# Altium project Sequential_Logic_Latch_FF.PrjPcb
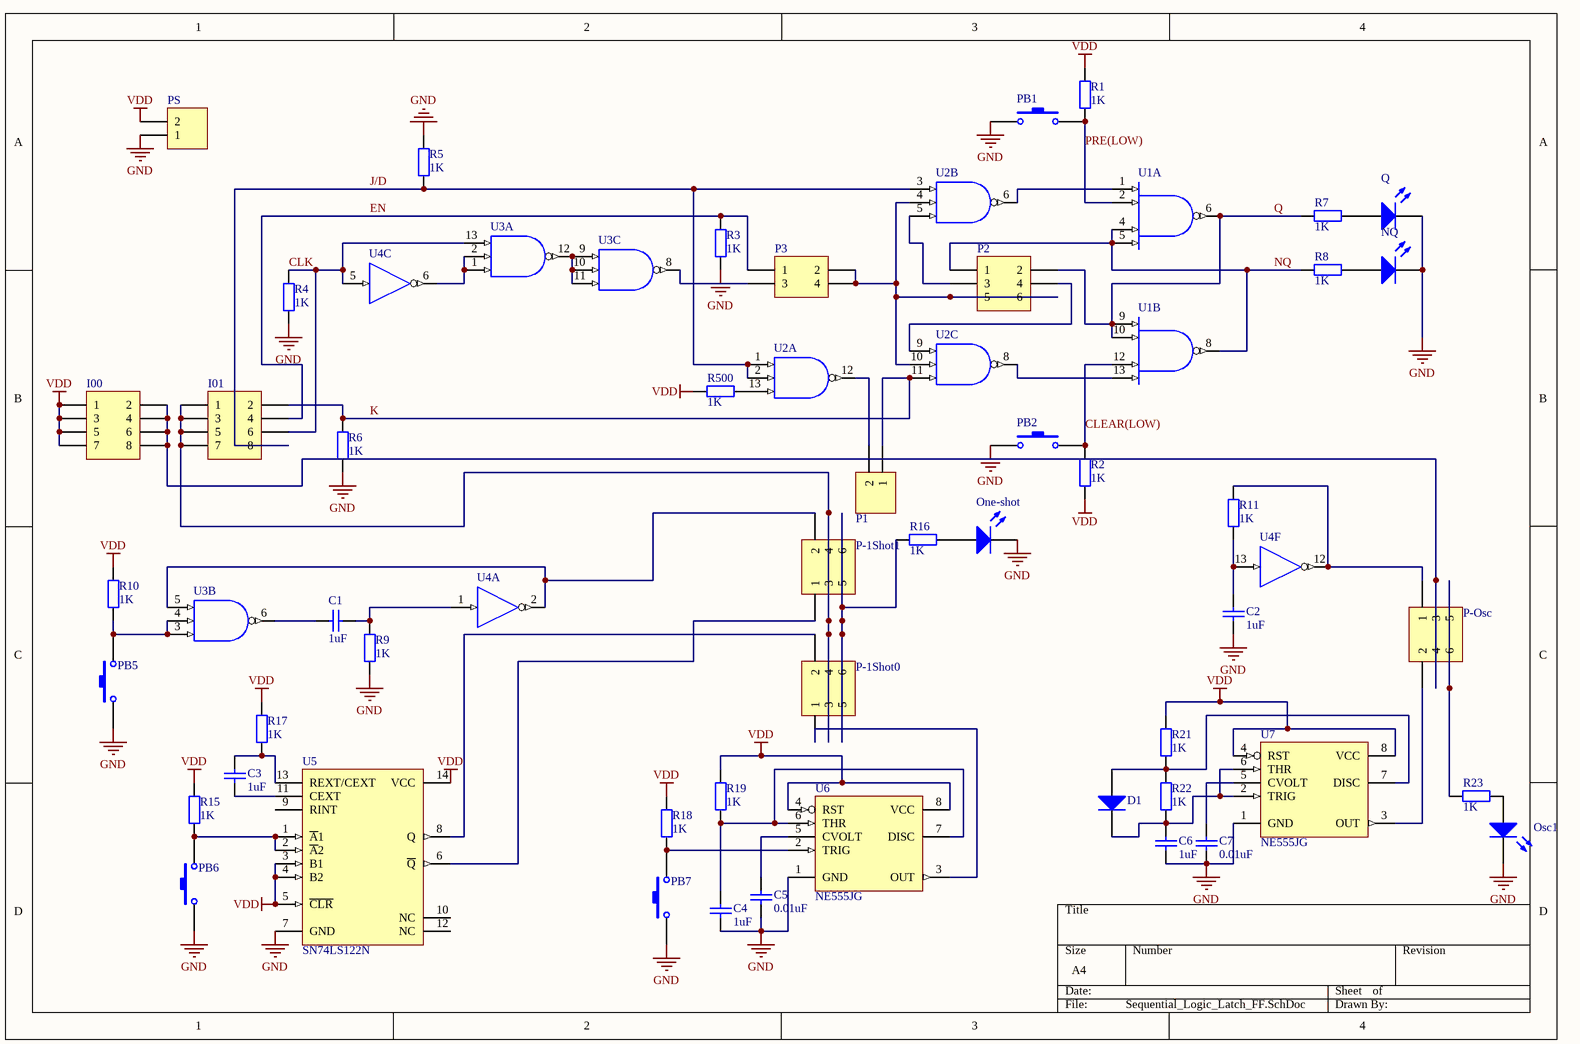
[diagram p0: Sequential_Logic_Latch_FF.SchDoc]
1 sheet, 53 parts. Net scope: global (net labels, ports and power ports of the same name join across sheets).
Board file: Sequential_Logic_Latch_FF.PcbDoc

## Sheet Sequential_Logic_Latch_FF.SchDoc
size A4

### Parts
C1  1uF  [RAD-0.3]
C2  1uF  [RAD-0.3]
C3  1uF  [RAD-0.3]
C4  1uF  [RAD-0.3]
C5  0.01uF  [RAD-0.3]
C6  1uF  [RAD-0.3]
C7  0.01uF  [RAD-0.3]
D1  Diode 1N4007  [DO-41]  (value not drawn)
I00  Header 4X2  [HDR2X4]  (value not drawn)
I01  Header 4X2  [HDR2X4]  (value not drawn)
NQ  LED0  [LED-0]  (value not drawn)
One-shot  LED0  [LED-0]  (value not drawn)
Osc1  LED0  [LED-0]  (value not drawn)
P1  Header 2  [HDR1X2]  (value not drawn)
P2  Header 3X2  [HDR2X3]  (value not drawn)
P3  Header 2X2  [HDR2X2]  (value not drawn)
P-1Shot0  Header 3X2  [HDR2X3]  (value not drawn)
P-1Shot1  Header 3X2  [HDR2X3]  (value not drawn)
P-Osc  Header 3X2  [HDR2X3]  (value not drawn)
PB1  SW-PB  [SPST-2]  (value not drawn)
PB2  SW-PB  [SPST-2]  (value not drawn)
PB5  SW-PB  [SPST-2]  (value not drawn)
PB6  SW-PB  [SPST-2]  (value not drawn)
PB7  SW-PB  [SPST-2]  (value not drawn)
PS  Header 2  [HDR1X2]  (value not drawn)
Q  LED0  [LED-0]  (value not drawn)
R1  1K  [AXIAL-0.4]
R2  1K  [AXIAL-0.4]
R3  1K  [AXIAL-0.4]
R4  1K  [AXIAL-0.4]
R5  1K  [AXIAL-0.4]
R6  1K  [AXIAL-0.4]
R7  1K  [AXIAL-0.4]
R8  1K  [AXIAL-0.4]
R9  1K  [AXIAL-0.4]
R10  1K  [AXIAL-0.4]
R11  1K  [AXIAL-0.4]
R15  1K  [AXIAL-0.4]
R16  1K  [AXIAL-0.4]
R17  1K  [AXIAL-0.4]
R18  1K  [AXIAL-0.4]
R19  1K  [AXIAL-0.4]
R21  1K  [AXIAL-0.4]
R22  1K  [AXIAL-0.4]
R23  1K  [AXIAL-0.4]
R500  1K  [AXIAL-0.4]
U1  MC74HC20N  [646-06]  (value not drawn)  (parts A,B of 2)
U2  MC74HC10N  [646-06]  (value not drawn)  (parts A,B,C of 3)
U3  MC74HC10N  [646-06]  (value not drawn)  (parts A,B,C of 3)
U4  MC74HC14AN  [646-06]  (value not drawn)  (parts A,C,F of 6)
U5  SN74LS122N  [N014]
U6  NE555JG  [JG008]
U7  NE555JG  [JG008]

### Nets
GND: C2.1 C4.1 C5.1 C6.1 C7.1 NQ.2(K) One-shot.2(K) Osc1.2(K) PB1.1 PB2.1 PB5.1 PB6.1 PB7.1 PS.1 Q.2(K) R3.1 R4.1 R5.2 R6.1 R9.1 U1.7(GND) U2.7(GND) U3.7(GND) U4.7(GND) U5.7(GND) U6.1(GND) U7.1(GND)
VDD: I00.1 I00.3 I00.5 I00.7 PS.2 R1.2 R2.1 R10.2 R15.2 R17.2 R18.2 R19.2 R21.1 R500.2 U1.14(VDD) U2.14(VDD) U3.14(VDD) U4.14(VDD) U5.3(B1) U5.4(B2) U5.5(~{CLR}) U5.14(VCC) U6.4(RST) U6.8(VCC) U7.4(RST) U7.8(VCC)
CLEAR(LOW): PB2.2 R2.2 U1.12(C)
CLK: I01.6 R4.2 U3.13(C) U4.5(A)
EN: I01.4 P3.1 R3.2
J/D: I01.8 R5.1 U2.1(A) U2.2(B) U2.3(A)
K: I01.2 P1.1 R6.2 U2.11(C)
NQ: P2.1 R8.1 U1.4(C) U1.5(D) U1.8(Y)
PRE(LOW): PB1.2 R1.1 U1.2(B)
Q: P2.2 R7.1 U1.6(Y) U1.9(A) U1.10(B)
NetC1_1: C1.1 U3.6(Y)
NetC1_2: C1.2 R9.2 U4.1(A)
NetC2_2: C2.2 R11.1 U4.13(A)
NetC3_1: C3.1 U5.11(CEXT)
NetC3_2: C3.2 R17.1 U5.13(REXT/CEXT)
NetC4_2: C4.2 R19.1 U6.6(THR) U6.7(DISC)
NetC5_2: C5.2 U6.5(CVOLT)
NetC6_2: C6.2 D1.2(K) R22.2 U7.2(TRIG) U7.6(THR)
NetC7_2: C7.2 U7.5(CVOLT)
NetD1_1: D1.1(A) R21.2 R22.1 U7.7(DISC)
NetI00_2: I00.2 I00.4 I00.6 I00.8 P-Osc.3 P-Osc.4
NetI01_1: I01.1 I01.3 I01.5 I01.7 P-1Shot0.3 P-1Shot0.4 P-1Shot1.3 P-1Shot1.4
NetNQ_1: NQ.1(A) R8.2
NetOne-shot_1: One-shot.1(A) R16.2
NetOsc1_1: Osc1.1(A) R23.2
NetP1_2: P1.2 U2.12(Y)
NetP2_3: P2.3 U2.5(C)
NetP2_4: P2.4 U2.9(A)
NetP2_5: P2.5 P2.6 P3.2 P3.4 U2.4(B) U2.10(B)
NetP3_3: P3.3 U3.8(Y)
NetP-1Shot0_1: P-1Shot0.1 U6.3(OUT)
NetP-1Shot0_2: P-1Shot0.2 U5.8(Q)
NetP-1Shot0_5: P-1Shot0.5 P-1Shot0.6 P-1Shot1.5 P-1Shot1.6 R16.1
NetP-1Shot1_1: P-1Shot1.1 U5.6(~{Q})
NetP-1Shot1_2: P-1Shot1.2 U3.5(C) U4.2(Y)
NetP-Osc_1: P-Osc.1 R11.2 U4.12(Y)
NetP-Osc_2: P-Osc.2 U7.3(OUT)
NetP-Osc_5: P-Osc.5 P-Osc.6 R23.1
NetPB5_2: PB5.2 R10.1 U3.3(A) U3.4(B)
NetPB6_2: PB6.2 R15.1 U5.1(~{A}1) U5.2(~{A}2)
NetPB7_2: PB7.2 R18.1 U6.2(TRIG)
NetQ_1: Q.1(A) R7.2
NetR500_1: R500.1 U2.13(C)
NetU1_1: U1.1(A) U2.6(Y)
NetU1_13: U1.13(D) U2.8(Y)
NetU3_1: U3.1(A) U3.2(B) U4.6(Y)
NetU3_9: U3.9(A) U3.10(B) U3.11(C) U3.12(Y)

Not connected (* = marked no-connect by the designer): U5 9(RINT) 10(NC) 12(NC)

### Library data of the parts
C1-C7 = Cap: Capacitor; Published: 8-Jun-2000; LatestRevisionDate: 17-Jul-2002; LatestRevisionNote: Re-released for DXP Platform.; PackageReference: RAD-0.3; Publisher: Altium Limited; PackageDescription: Radial Cap, Thru-Hole; 2 Leads; 0.3 in Pin Spacing
  C1-C4 C6: Value: 1uF
  C5 C7: Value: 0.01uF
D1 = Diode 1N4007: 1 Amp General Purpose Rectifier; Published: 8-Jun-2000; LatestRevisionDate: 17-Jul-2002; LatestRevisionNote: Re-released for DXP Platform.; DatasheetVersion: 1998; PackageVersion: Aug-1999; PackageReference: DO-41; Publisher: Altium Limited; PackageDescription: Diode, Axial; Body 5.2 x 2.7 mm (LxDia. max), Lead Dia. 0.86 mm (max); Code_JEDEC: DO-204-AL; ComponentLink1Description: Manufacturer Link; ComponentLink1URL: http://www.fairchildsemi.com/; ComponentLink2Description: Datasheet; ComponentLink2URL: http://www.fairchildsemi.com/ds/1N%2F1N4001.pdf
I00 I01 = Header 4X2: Header, 4-Pin, Dual row; LatestRevisionDate: 17-Jul-2002; LatestRevisionNote: Re-released for DXP Platform.; Publisher: Altium Limited
NQ One-shot Osc1 Q = LED0: Typical INFRARED GaAs LED; Published: 8-Jun-2000; LatestRevisionDate: 08-Jul-2005; LatestRevisionNote: Mech Layer 1 removed.; PackageReference: LED-0; Publisher: Altium Limited; PackageDescription: LED; 2 Leads
P1 PS = Header 2: Header, 2-Pin; LatestRevisionDate: 17-Jul-2002; LatestRevisionNote: Re-released for DXP Platform.; Publisher: Altium Limited
P2 P-1Shot0 P-1Shot1 P-Osc = Header 3X2: Header, 3-Pin, Dual row; LatestRevisionDate: 17-Jul-2002; LatestRevisionNote: Re-released for DXP Platform.; Publisher: Altium Limited
P3 = Header 2X2: Header, 2-Pin, Dual row; LatestRevisionDate: 17-Jul-2002; LatestRevisionNote: Re-released for DXP Platform.; Publisher: Altium Limited
PB1 PB2 PB5-PB7 = SW-PB: Switch; Published: 24-Mar-1999; LatestRevisionDate: 17-Jul-2002; LatestRevisionNote: Re-released for DXP Platform.; PackageReference: SPST-2; Publisher: Altium Limited; PackageDescription: Switch; 2 Leads
R1-R11 R15-R19 R21-R23 R500 = Res2: Resistor; Published: 8-Jun-2000; LatestRevisionDate: 17-Jul-2002; LatestRevisionNote: Re-released for DXP Platform.; PackageReference: AXIAL-0.4; Publisher: Altium Limited; PackageDescription: Axial Device, Thru-Hole; 2 Leads; 0.4 in Pin Spacing; Value: 1K
U1 = MC74HC20N: Dual 4-Input NAND Gate; Note: Pins 3,11 are Not Connected and not drawn.; Published: 17-Jul-2002; LatestRevisionDate: 06-Jun-2005; LatestRevisionNote: Stylized 3D Model Added; DatasheetVersion: 1989; PackageVersion: 1997; PackageReference: 646-06; Publisher: Altium Limited; PackageDescription: DIP; 14 Leads; Row Spacing 7.62 mm; Pitch 2.54 mm; ComponentLink1Description: Manufacturer Link; ComponentLink1URL: http://www.onsemi.com/site/products/parametrics/0,4446,247,00.html; ComponentLink2Description: Ibis Model; ComponentLink2URL: http://www.onsemi.com/pub/Collateral/MC54HC20J.IBS
U2 U3 = MC74HC10N: Triple 3-Input NAND Gate; Published: 17-Jul-2002; LatestRevisionDate: 06-Jun-2005; LatestRevisionNote: Stylized 3D Model Added; DatasheetVersion: 1989; PackageVersion: 1997; PackageReference: 646-06; Publisher: Altium Limited; PackageDescription: DIP; 14 Leads; Row Spacing 7.62 mm; Pitch 2.54 mm; ComponentLink1Description: Manufacturer Link; ComponentLink1URL: http://www.onsemi.com/site/products/parametrics/0,4446,247,00.html; ComponentLink2Description: Ibis Model; ComponentLink2URL: http://www.onsemi.com/pub/Collateral/MC54HC10J.IBS
U4 = MC74HC14AN: Hex Schmitt Trigger Inverter; Published: 17-Jul-2002; LatestRevisionDate: 06-Jun-2005; LatestRevisionNote: Stylized 3D Model Added; DatasheetVersion: 1989; PackageVersion: 1997; PackageReference: 646-06; Publisher: Altium Limited; PackageDescription: DIP; 14 Leads; Row Spacing 7.62 mm; Pitch 2.54 mm; ComponentLink1Description: Manufacturer Link; ComponentLink1URL: http://www.onsemi.com/site/products/parametrics/0,4446,247,00.html; ComponentLink2Description: Ibis Model; ComponentLink2URL: http://www.onsemi.com/pub/Collateral/MC54HC14AJ.IBS
U5 = SN74LS122N: Retriggerable Monostable Multivibrator; Note: Pins No 10 and 12 are not connected and not drawn; Published: 8-Jun-2000; LatestRevisionDate: 04-Mar-2005; LatestRevisionNote: Stylized 3D Model Added.; DatasheetVersion: Mar-1988; PackageVersion: Oct-1995; PackageReference: N014; Publisher: Altium Limited; PackageDescription: DIP; 14 Leads; Row Spacing 7.62 mm; Pitch 2.54 mm; ComponentLink1Description: Manufacturer Link; ComponentLink1URL: http://www.ti.com/; ComponentLink2Description: Datasheet; ComponentLink2URL: http://www-s.ti.com/sc/ds/sn74ls123.pdf
U6 U7 = NE555JG: Precision Timer; Published: 16-Jan-2001; LatestRevisionDate: 04-Mar-2005; LatestRevisionNote: Stylized 3D Model Added.; DatasheetVersion: Feb-1992; PackageVersion: Jan-1995; PackageReference: JG008; Publisher: Altium Limited; PackageDescription: DIP; 8 Leads; Row Spacing 7.62 mm; Pitch 2.54 mm; ComponentLink1Description: Manufacturer Link; ComponentLink1URL: http://www.ti.com/; ComponentLink2Description: Datasheet; ComponentLink2URL: http://www-s.ti.com/sc/ds/ne555.pdf